# Altium project ActiveCapElectrodes_v2.0.PrjPcb
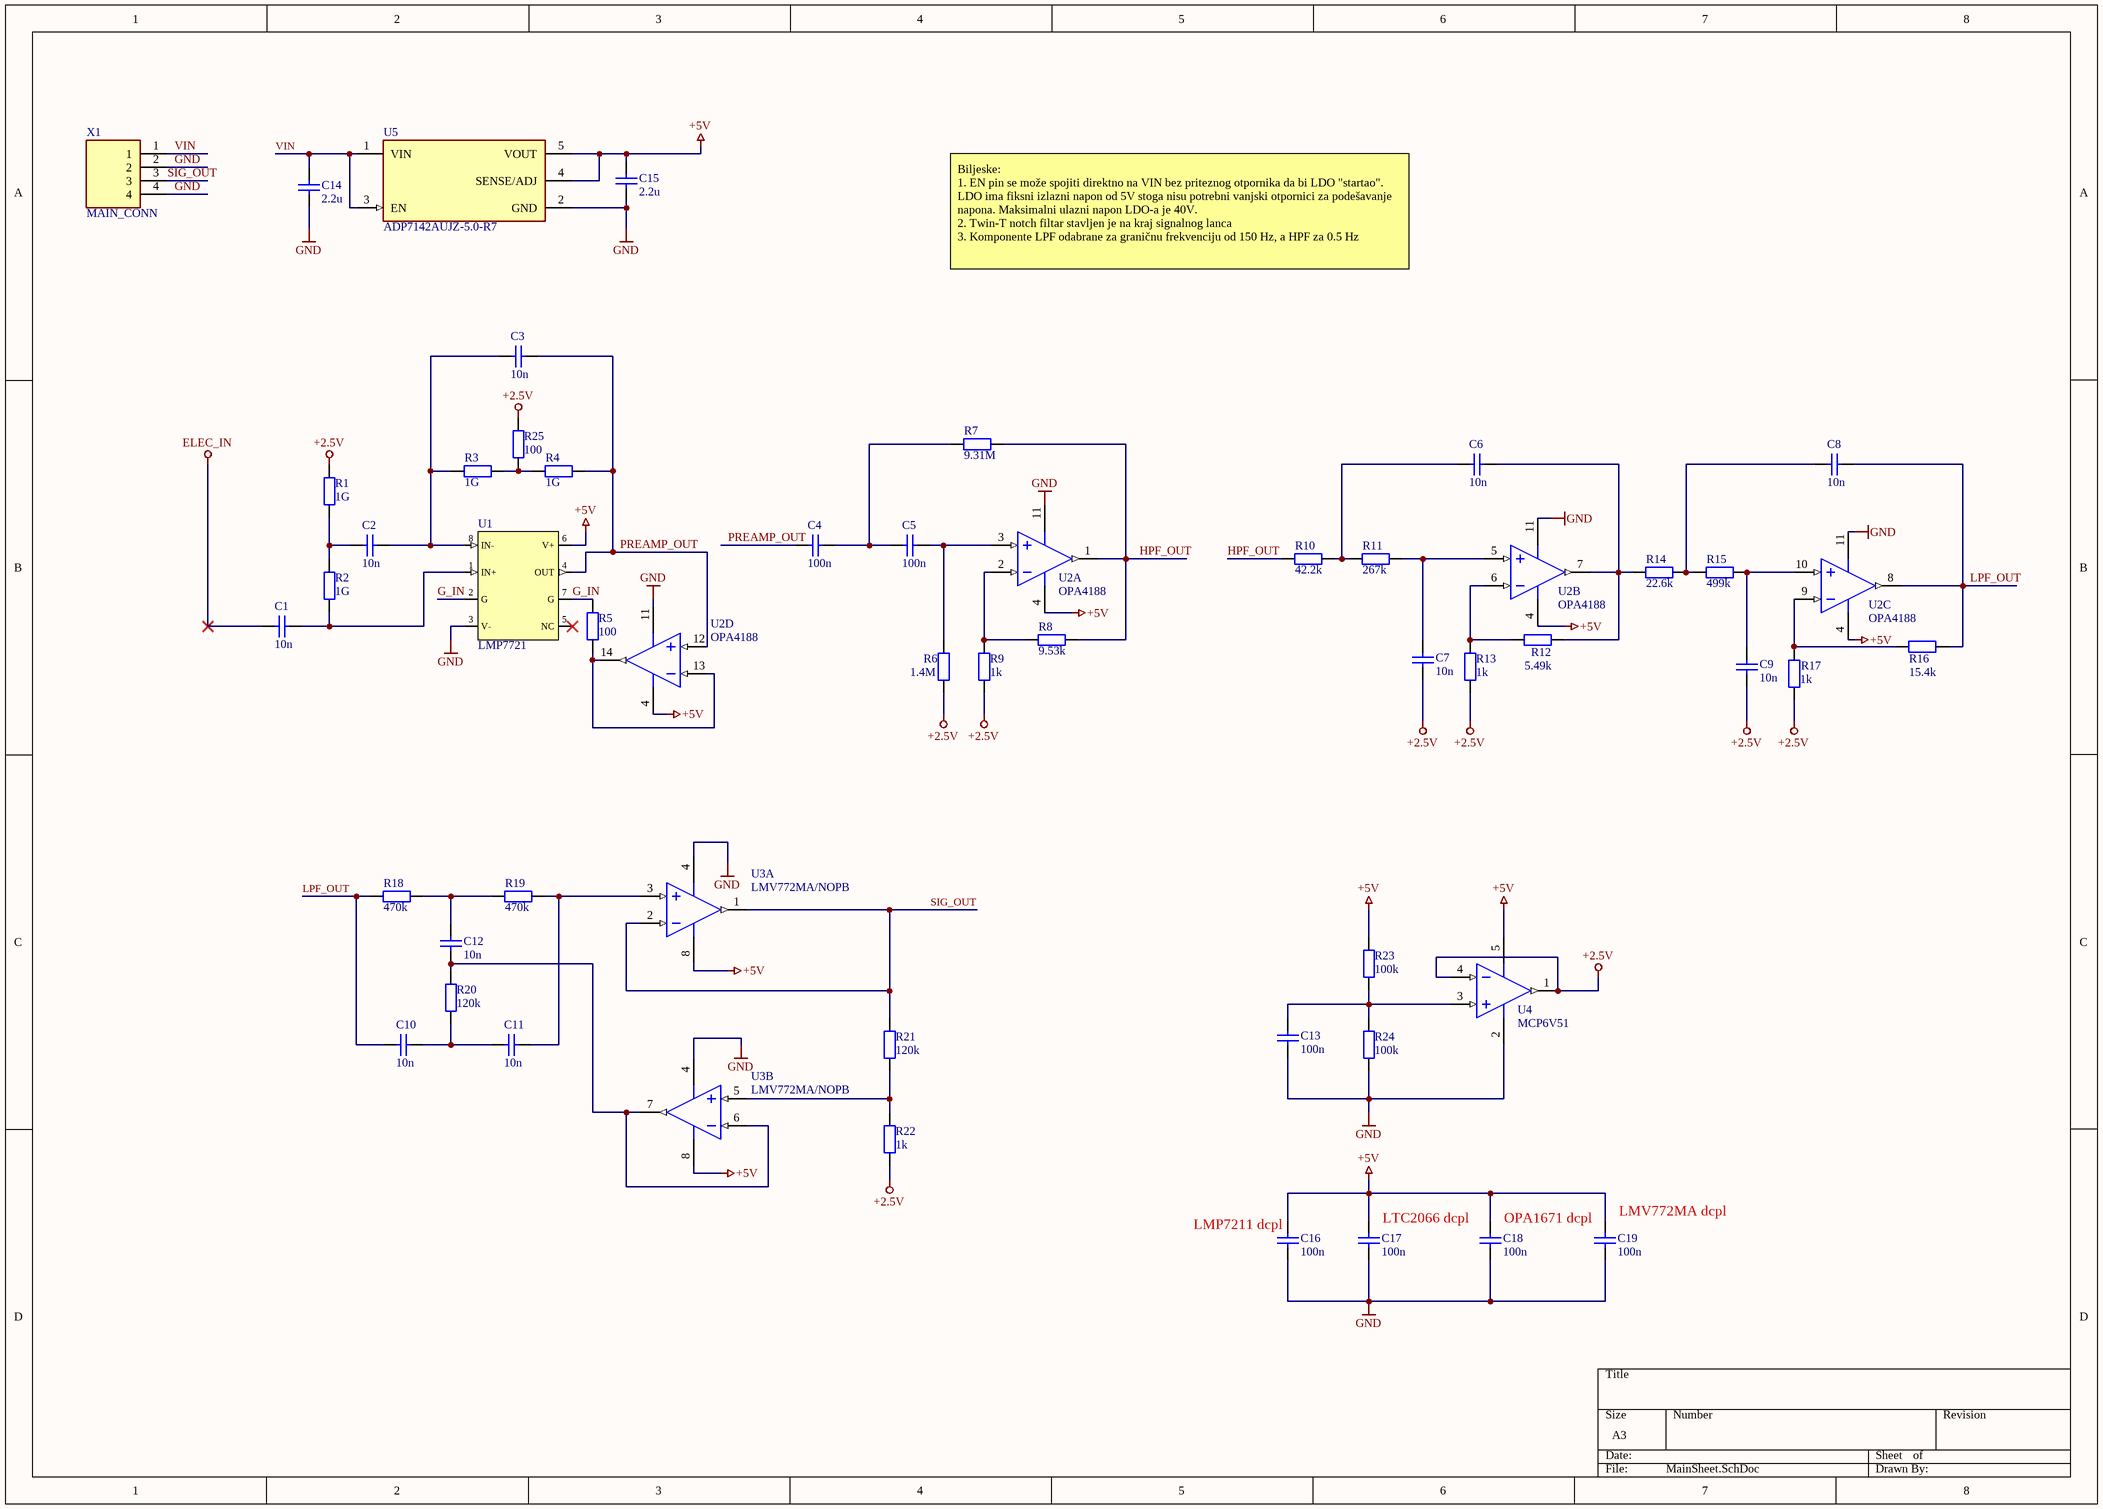
[diagram p0: MainSheet.SchDoc]
Author: Dino Cindric; Year: 2022
1 sheet, 50 parts. Net scope: global (net labels, ports and power ports of the same name join across sheets).
Board file: CapElectrodes_v2.0.PcbDoc

## Sheet MainSheet.SchDoc
size A3; SheetNumber: 1; SheetTotal: 1

### Parts
C1  10n  [CAP_0603]
C2  10n  [CAP_0603]
C3  10n  [CAP_0603]
C4  100n  [CAPC3216X190]
C5  100n  [CAPC3216X190]
C6  10n  [CAP_0603]
C7  10n  [CAP_0603]
C8  10n  [CAP_0603]
C9  10n  [CAP_0603]
C10  10n  [CAP_0603]
C11  10n  [CAP_0603]
C12  10n  [CAP_0603]
C13  100n  [CAP_0603]
C14  2.2u  [CAP_0805]
C15  2.2u  [CAP_0805]
C16  100n  [CAP_0603]
C17  100n  [CAP_0603]
C18  100n  [CAP_0603]
C19  100n  [CAP_0603]
R1  1G  [RESC2012X60N]
R2  1G  [RESC2012X60N]
R3  1G  [RESC2012X60N]
R4  1G  [RESC2012X60N]
R5  100  [RES_0603]
R6  1.4M  [RES_0603]
R7  9.31M  [RES_0603]
R8  9.53k  [RES_0603]
R9  1k  [RES_0603]
R10  42.2k  [RES_0603]
R11  267k  [RES_0603]
R12  5.49k  [RES_0603]
R13  1k  [RES_0603]
R14  22.6k  [RES_0603]
R15  499k  [RES_0603]
R16  15.4k  [RES_0603]
R17  1k  [RES_0603]
R18  470k  [RES_0603]
R19  470k  [RES_0603]
R20  120k  [RES_0603]
R21  120k  [RES_0603]
R22  1k  [RES_0603]
R23  100k  [RES_0603]
R24  100k  [RES_0603]
R25  100  [RES_0603]
U1  LMP7721  [SOIC127P600X175-8N]
U2  OPA4188  [SOP65P640X120-14N]  (parts A,B,C,D of 4)
U3  LMV772MA/NOPB  [D0008A_M]  (parts A,B of 2)
U4  MCP6V51  [SOT95P280X145-5N]
U5  ADP7142AUJZ-5.0-R7  [FP-UJ-5-IPC_B]
X1  MAIN_CONN  [SHDRRA4W50P15X200_1X4_1000X770X525P]

### Nets
+2.5V: C7.1 C9.1 R1.1 R6.1 R9.1 R13.2 R17.2 R22.1 R25.2 U4.1(OUT) U4.4(IN-)
+5V: C15.1 C16.2 C17.2 C18.2 C19.2 R23.1 U1.6(V+) U2.4(+VS) U3.8(V+) U4.5(V+) U5.4(SENSE/ADJ) U5.5(VOUT)
ELEC_IN: C1.1
GND: C13.1 C14.2 C15.2 C16.1 C17.1 C18.1 C19.1 R24.2 U1.3(V-) U2.11(-VS) U3.4(V-) U4.2(V-) U5.2(GND) X1.2 X1.4
G_IN: R5.1 U1.2(G) U1.7(G)
HPF_OUT: R7.2 R8.1 R10.1 U2.1(OUT_1)
LPF_OUT: C8.1 C10.2 R16.1 R18.1 U2.8(OUT_3)
PREAMP_OUT: C3.2 C4.1 R4.2 U1.4(OUT) U2.12(+IN_4)
SIG_OUT: R21.2 U3.1(OUTA) U3.2(INA-) X1.3
VIN: C14.1 U5.1(VIN) U5.3(EN) X1.1
NetC1_2: C1.2 R2.2 U1.1(IN+)
NetC2_1: C2.1 R1.2 R2.1
NetC2_2: C2.2 C3.1 R3.1 U1.8(IN-)
NetC4_2: C4.2 C5.1 R7.1
NetC5_2: C5.2 R6.2 U2.3(+IN_1)
NetC6_1: C6.1 R12.1 R14.1 U2.7(OUT_2)
NetC6_2: C6.2 R10.2 R11.1
NetC7_2: C7.2 R11.2 U2.5(+IN_2)
NetC8_2: C8.2 R14.2 R15.1
NetC9_2: C9.2 R15.2 U2.10(+IN_3)
NetC10_1: C10.1 C11.2 R20.1
NetC11_1: C11.1 R19.2 U3.3(INA+)
NetC12_1: C12.1 R20.2 U3.6(INB-) U3.7(OUTB)
NetC12_2: C12.2 R18.2 R19.1
NetC13_2: C13.2 R23.2 R24.1 U4.3(IN+)
NetR3_2: R3.2 R4.1 R25.1
NetR5_2: R5.2 U2.13(-IN_4) U2.14(OUT_4)
NetR8_2: R8.2 R9.2 U2.2(-IN_1)
NetR12_2: R12.2 R13.1 U2.6(-IN_2)
NetR16_2: R16.2 R17.1 U2.9(-IN_3)
NetR21_1: R21.1 R22.2 U3.5(INB+)

Not connected (* = marked no-connect by the designer): U1 5(NC)*

### Notes on the sheet
- Biljeske:
  1. EN pin se može spojiti direktno na VIN bez priteznog otpornika da bi LDO "startao". LDO ima fiksni izlazni napon od 5V stoga nisu potrebni vanjski otpornici za podešavanje napona. Maksimalni ulazni napon LDO-a je 40V.
  2. Twin-T notch filtar stavljen je na kraj signalnog lanca
  3. Komponente LPF odabrane za graničnu frekvenciju od 150 Hz, a HPF za 0.5 Hz
- (near C16) LMP7211 dcpl
- LTC2066 dcpl
- OPA1671 dcpl
- (near C19) LMV772MA dcpl

### Library data of the parts
C1 C2 = Cap: C0603C103J3GACTU; Published: 8-Jun-2000; LatestRevisionDate: 17-Jul-2002; LatestRevisionNote: Re-released for DXP Platform.; PackageReference: RAD-0.3; Publisher: Altium Limited; PackageDescription: Radial Cap, Thru-Hole; 2 Leads; 0.3 in Pin Spacing; Value: 10n
C3 = Cap: C0603C103J3GACTU; Value: 100u; Published: 8-Jun-2000; LatestRevisionDate: 17-Jul-2002; LatestRevisionNote: Re-released for DXP Platform.; PackageReference: RAD-0.3; Publisher: Altium Limited; PackageDescription: Radial Cap, Thru-Hole; 2 Leads; 0.3 in Pin Spacing
C4-C12 C14 C15 = Cap: Capacitor; Value: 100pF; Published: 8-Jun-2000; LatestRevisionDate: 17-Jul-2002; LatestRevisionNote: Re-released for DXP Platform.; PackageReference: RAD-0.3; Publisher: Altium Limited; PackageDescription: Radial Cap, Thru-Hole; 2 Leads; 0.3 in Pin Spacing
C13 = Cap: MC0402B104K100CT; Manufacturer 1: Taiyo Yuden; Manufacturer Part Number 1: EMK107B7104KA-T
C16 C18 C19 = Cap: MC0402B104K100CT; Value: 100pF; Published: 8-Jun-2000; LatestRevisionDate: 17-Jul-2002; LatestRevisionNote: Re-released for DXP Platform.; PackageReference: RAD-0.3; Publisher: Altium Limited; PackageDescription: Radial Cap, Thru-Hole; 2 Leads; 0.3 in Pin Spacing
C17 = Cap: MC0402B104K100CT; Published: 8-Jun-2000; LatestRevisionDate: 17-Jul-2002; LatestRevisionNote: Re-released for DXP Platform.; PackageReference: RAD-0.3; Publisher: Altium Limited; PackageDescription: Radial Cap, Thru-Hole; 2 Leads; 0.3 in Pin Spacing
R1-R4 = Res2: HR0805F-1G0JI; Value: 10GΩ; Published: 8-Jun-2000; LatestRevisionDate: 17-Jul-2002; LatestRevisionNote: Re-released for DXP Platform.; PackageReference: AXIAL-0.4; Publisher: Altium Limited; PackageDescription: Axial Device, Thru-Hole; 2 Leads; 0.4 in Pin Spacing
R5 R25 = Res2: CPF0402B100RE1; Value: 1K; Published: 8-Jun-2000; LatestRevisionDate: 17-Jul-2002; LatestRevisionNote: Re-released for DXP Platform.; PackageReference: AXIAL-0.4; Publisher: Altium Limited; PackageDescription: Axial Device, Thru-Hole; 2 Leads; 0.4 in Pin Spacing
R6-R8 R10-R12 R14-R16 R18-R21 = Res2: Resistor; Value: 1K; Published: 8-Jun-2000; LatestRevisionDate: 17-Jul-2002; LatestRevisionNote: Re-released for DXP Platform.; PackageReference: AXIAL-0.4; Publisher: Altium Limited; PackageDescription: Axial Device, Thru-Hole; 2 Leads; 0.4 in Pin Spacing
R9 R13 R17 R22 = Res2: Resistor; Published: 8-Jun-2000; LatestRevisionDate: 17-Jul-2002; LatestRevisionNote: Re-released for DXP Platform.; PackageReference: AXIAL-0.4; Publisher: Altium Limited; PackageDescription: Axial Device, Thru-Hole; 2 Leads; 0.4 in Pin Spacing; Value: 1K
R23 = Res2: MCS04020C1003FE000; Manufacturer 1: Bourns; Manufacturer Part Number 1: CR0603-FX-1203ELF
R24 = Res2: MCS04020C1003FE000; Manufacturer 1: Panasonic; Manufacturer Part Number 1: ERJ-3EKF1003V
U1 = LMP7721: LMP7721 3-Femtoampere Input Bias Current Precision Amplifier
U2 = AD713AQ: Quad Channel Operational Amplifier, 4 MHz BW, 20 V/us SR, Industrial, 14-pin DIP (Q-14), Tube; Generic Part Number: AD713; Manufacturer: Analog Devices; Amplifiers Per Package: 4; Input Bias Current: 40pA; Input Offset Voltage: 300uV; Iq/Amp: 3mA; Slew Rate: 20V/us; Small Signal Bandwidth: 4MHz; V Span Max: 36V; V Span Min: 9V; DatasheetVersion: Rev. F; PackageReference: Q-14; PackageDescription: 14-Pin Ceramic Dual In-Line Package, Row spacing 7.62 mm, Pitch 2.54 mm; Supplier 1: Digi-Key; Supplier Part Number 1: AD713AQ-ND; Supplier 2: Farnell; Supplier Part Number 2: 1646254; Supplier 3: Newark; Supplier Part Number 3: 66F5831; Packing: Tube; Mounting Technology: Through Hole; PartNumber: AD713AQ; ComponentLink1Description: Manufacturer URL; ComponentLink1URL: http://www.analog.com/en/index.html; ComponentLink2Description: Datasheet; ComponentLink2URL: http://www.analog.com/static/imported-files/data_sheets/AD713.pdf; ComponentLink3Description: Package Specification; ComponentLink3URL: http://www.analog.com/static/imported-files/packages/393665681442905251546090Q_14.pdf
U3 = CMP-0055-00492-4: Dual, Low Offset, Low Noise, RRO Operational Amplifier, 8-pin Narrow SOIC, Pb-Free, 95 Rail; Manufacturer: Texas Instruments; PowerWise: N; CompType: Amplifiers; PackageTopMarking: NSZXTT*LMV7*72MA; High-Reliability: Y; RoHS: Y; PinCount: 8; Code_JEDEC: MS-012-AA; ComponentLink1Description: Datasheet URL; PackageDescription: SOIC Narrow, 4.9 x 3.9 x 1.45mm, 8 Lead, 1.27mm Pitch; ComponentLink1URL: http://www.ti.com/general/docs/lit/getliterature.tsp?genericPartNumber=LMV772&fileType=pdf; Package Reference: D0008A; PartNumber: LMV772MA/NOPB; Code_IPC: SOIC127P600-8
U4 = OPA336NJ/250: MCP6V51T-E/OT; Manufacturer 1: Texas Instruments; Manufacturer Part Number 1: OPA1671IDBVR
U5 = CMP-09138-000124-1: IC REG LINEAR 5V 200MA TSOT23-5; Number of Regulators: 1; Output Type: Fixed; Polarity: Positive; Max Input Voltage: 40V; Min Input Voltage: 2.7V; Accuracy: 0.8%; Min Current Limit: 250mA; Quiescent Current: 50uA; Dropout Voltage: 200mV; Power Supply Rejection Ratio (PSRR): 88dB; Operating Supply Current: 180uA; Input Bias Current: 1uA; Number of Outputs: 1; Output Voltage: 5V; Max Output Current: 200mA; Mount: Surface Mount; Output Current: 200mA; Min Operating Temperature: -40°C; Package Quantity: 3000; Contact Plating: Gold; Max Operating Temperature: 125°C; Packaging: Tape and Reel; Lead Free: Contains Lead; Case/Package: SOT-23-5; Number of Pins: 5; RoHS Compliant: Yes
X1 = 440055-4: Connector; Manufacturer_Name: TE Connectivity; Datasheet Link: https://componentsearchengine.com//440055-4.pdf; Height: 5.25mm; Mouser2 Part Number: 571-440055-4; Mouser2 Price/Stock: https://www.mouser.com/Search/Refine.aspx?Keyword=571-440055-4; Manufacturer_Part_Number: 440055-4